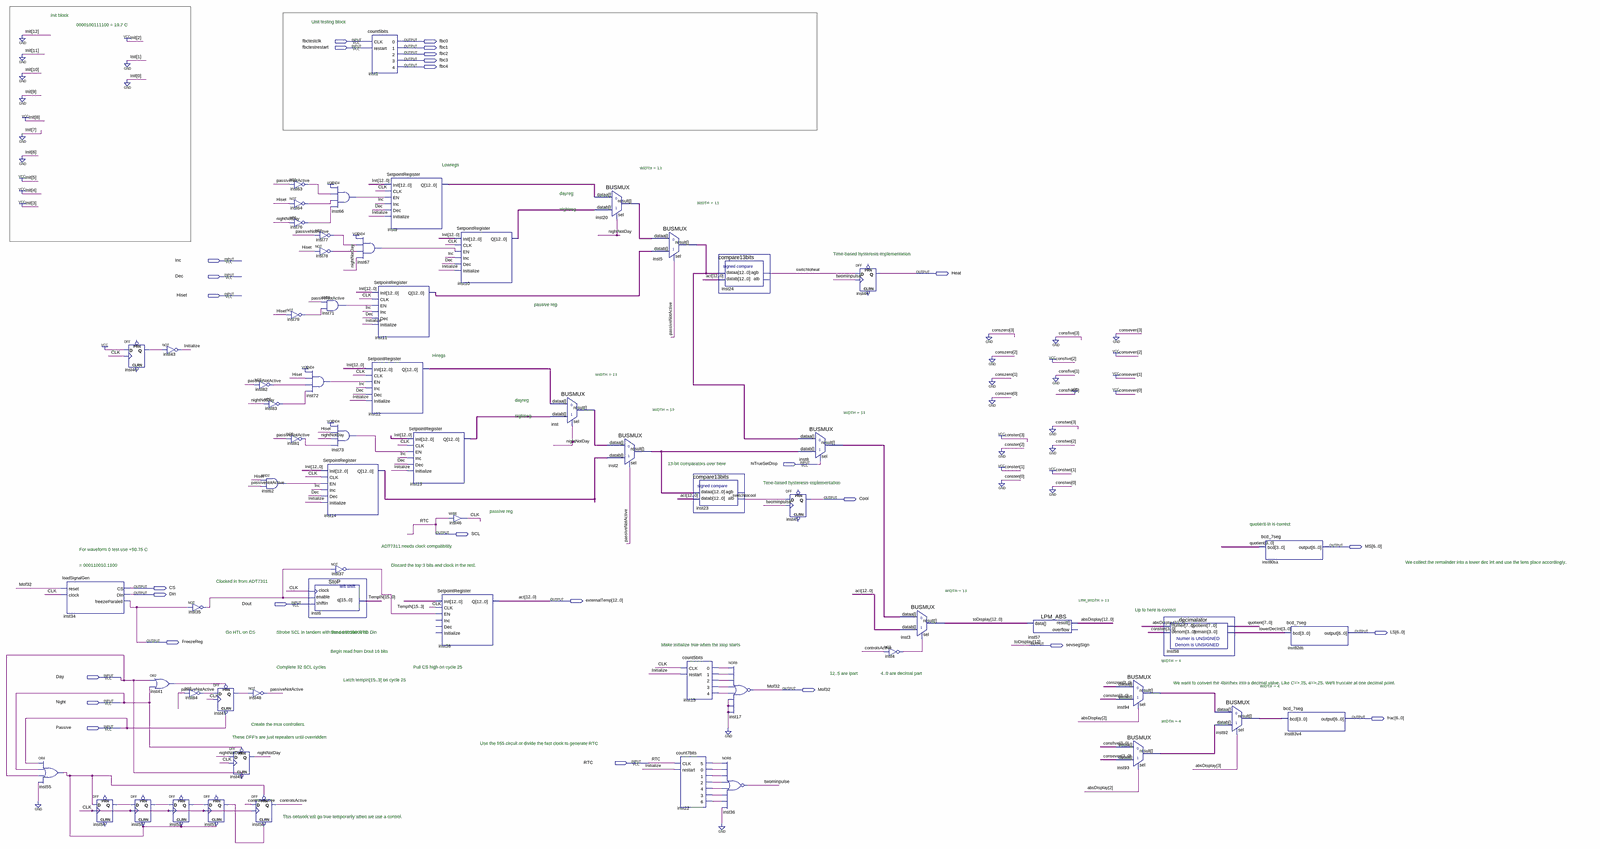
[diagram p0: schematic sheet, whole]
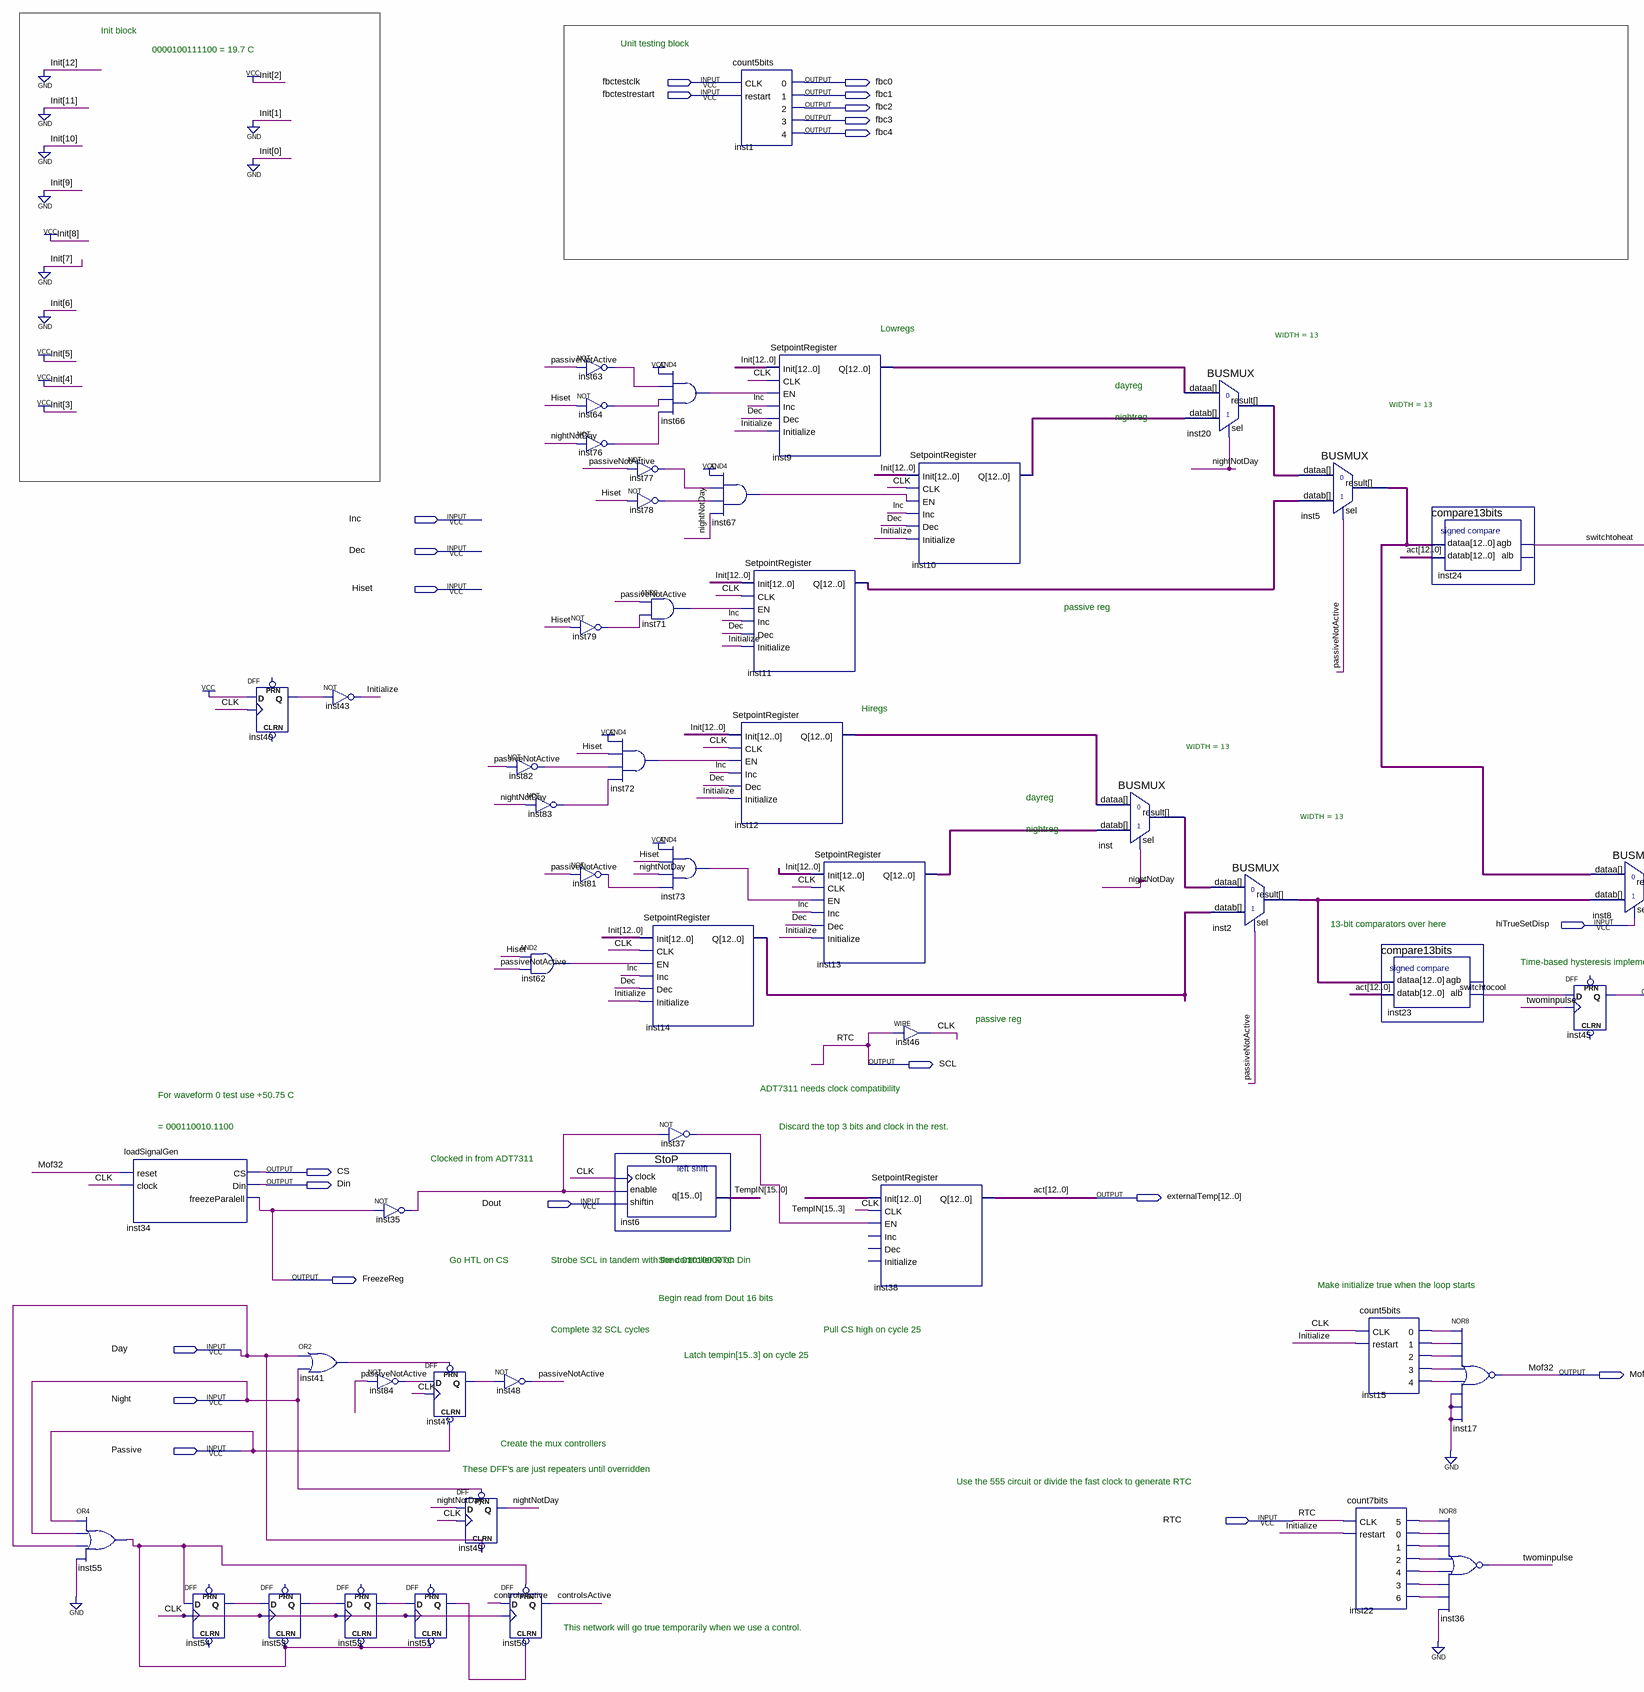
[diagram p1: schematic sheet, left part]
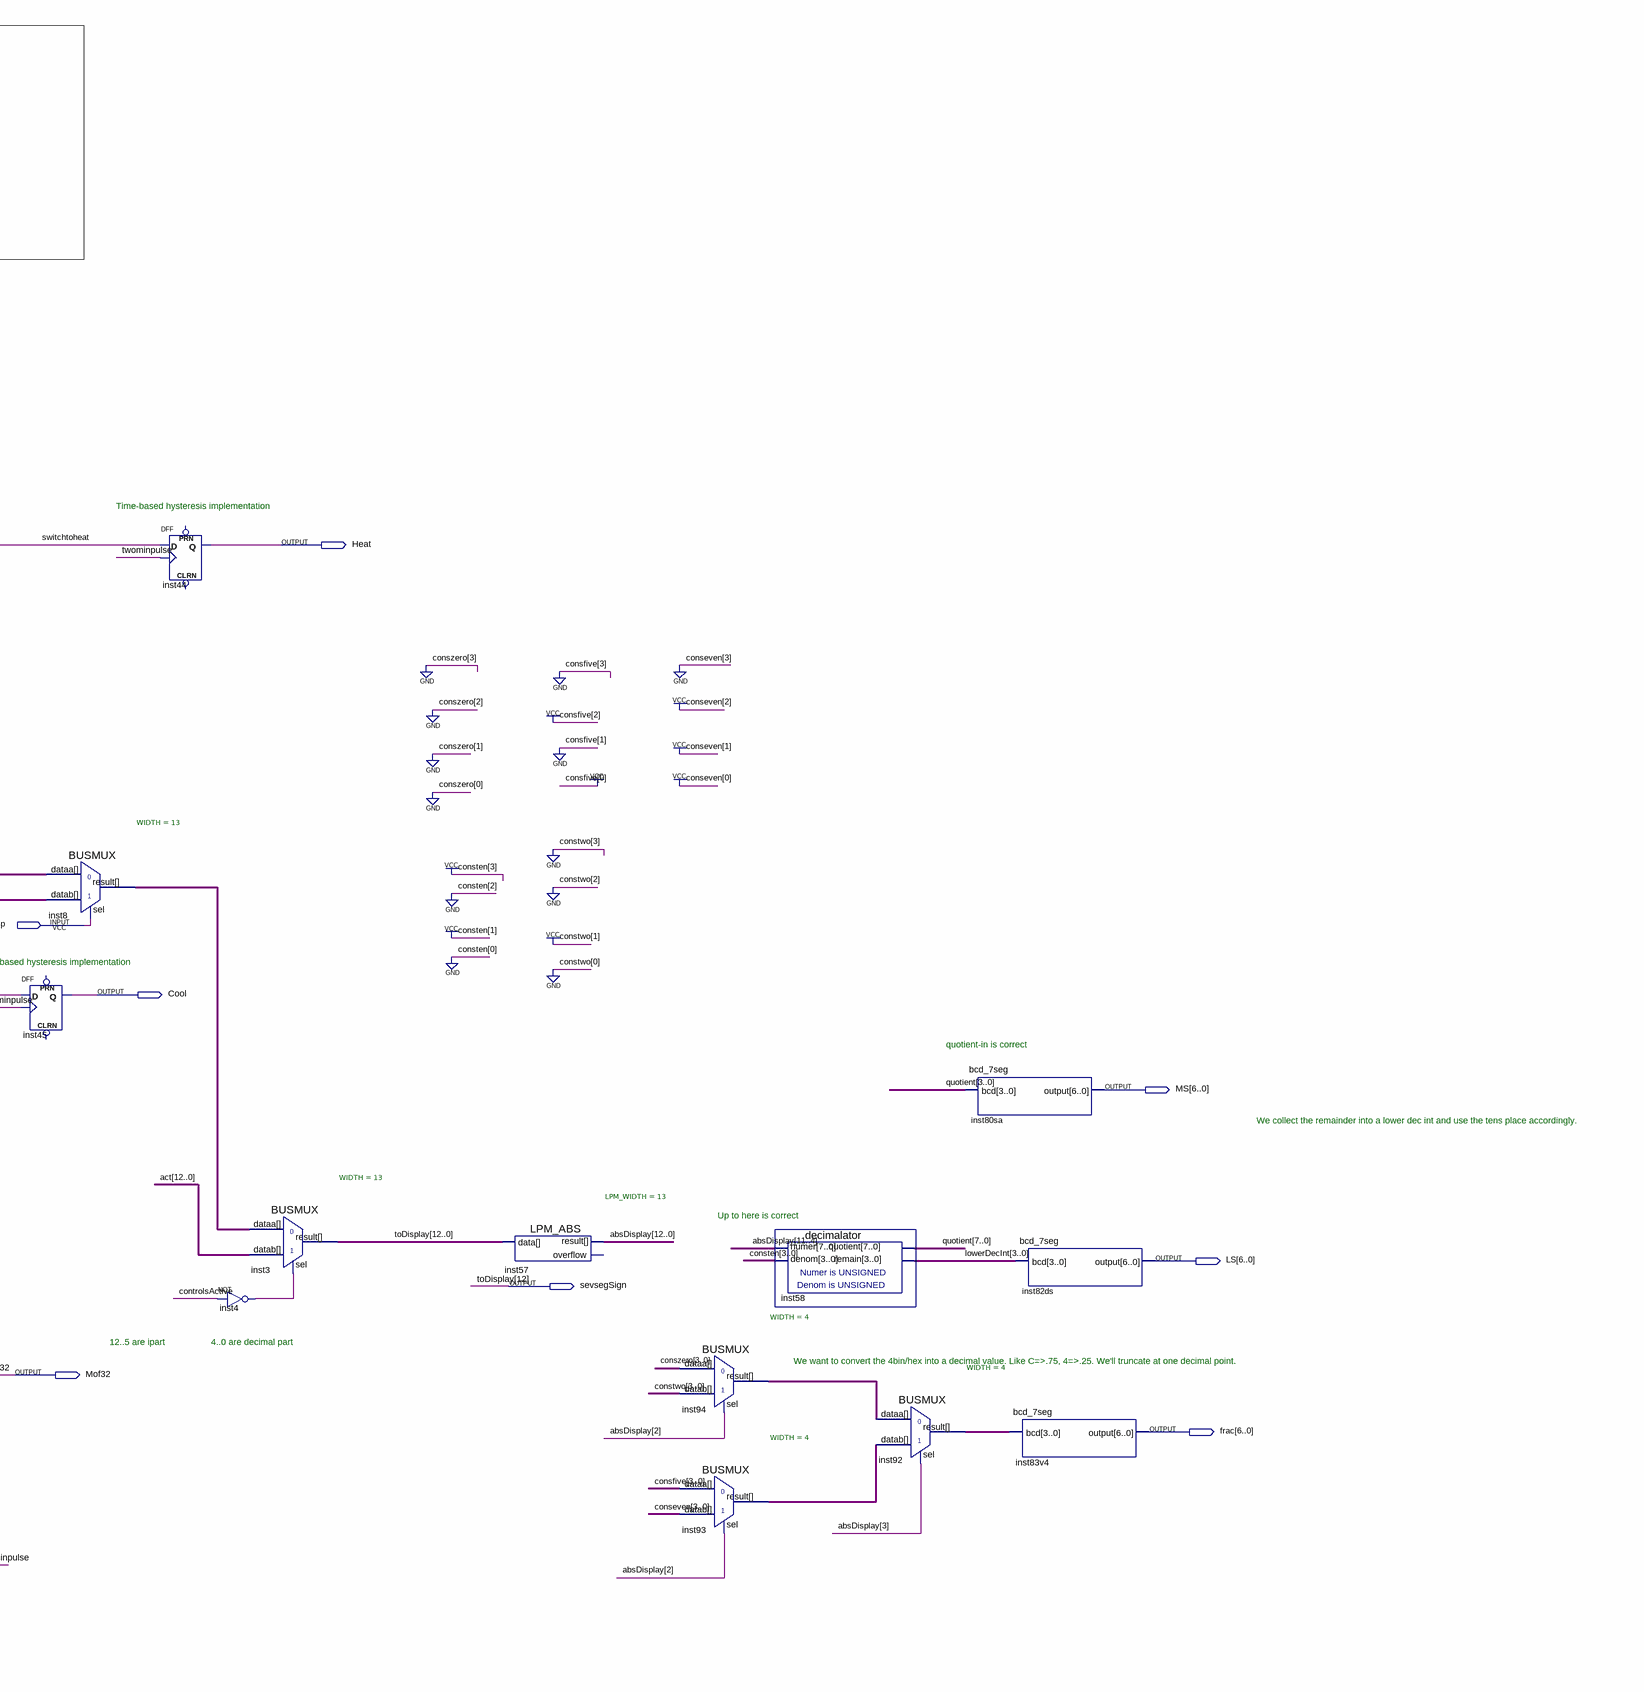
[diagram p2: schematic sheet, right part]
// Quartus schematic HexpointThermostat.bdf as structural Verilog: 64 symbols, 28 pins
module HexpointThermostat (
  input  fbctestclk,
  input  fbctestrestart,
  input  Inc,
  input  Dec,
  input  Hiset,
  input  hiTrueSetDisp,
  input  Dout,
  input  Day,
  input  Night,
  input  Passive,
  input  RTC,
  output fbc0,
  output fbc1,
  output fbc2,
  output fbc3,
  output fbc4,
  output Heat,
  output Cool,
  output SCL,
  output [6:0] MS,
  output CS,
  output Din,
  output [12:0] externalTemp,
  output [6:0] LS,
  output FreezeReg,
  output sevsegSign,
  output Mof32,
  output [6:0] frac
);

  wire CLK, controlsActive, Initialize, inst4_out, inst15_0, inst15_1, inst15_2, inst15_3, inst15_4,
       inst22_0, inst22_1, inst22_2, inst22_3, inst22_4, inst22_5, inst22_6, inst35_out, inst37_out,
       inst40_q, inst41_out, inst47_q, inst51_q, inst52_q, inst53_q, inst54_q, inst55_out, inst62_out,
       inst63_out, inst64_out, inst66_out, inst67_out, inst71_out, inst72_out, inst73_out, inst76_out,
       inst77_out, inst78_out, inst79_out, inst81_out, inst82_out, inst83_out, inst84_out, nightNotDay,
       passiveNotActive, switchtocool, switchtoheat, twominpulse;
  wire [3:0] inst92_result, inst93_result, inst94_result, lowerDecInt;
  wire [7:0] quotient;
  wire [11:0] toDisplay;
  wire [12:0] absDisplay, inst2_result, inst5_result, inst8_result, inst9_q, inst10_q, inst11_q, inst12_q,
       inst13_q, inst14_q, inst20_result, inst_result;
  wire [15:0] TempIN;

  or inst55 (inst55_out, Passive, Night, Day, 1'b0);
  loadSignalGen inst34 (.reset(Mof32), .clock(CLK), .CS(CS), .Din(Din), .freezeParalell(FreezeReg));
  DFF inst54 (.CLK(CLK), .D(inst55_out), .Q(inst54_q));  // open: CLRN, PRN
  DFF inst40 (.CLK(CLK), .D(1'b1), .Q(inst40_q));  // open: CLRN, PRN
  DFF inst53 (.CLRN(inst55_out), .CLK(CLK), .D(inst54_q), .Q(inst53_q));  // open: PRN
  not inst43 (Initialize, inst40_q);
  or inst41 (inst41_out, Day, Night);
  DFF inst52 (.CLRN(inst55_out), .CLK(CLK), .D(inst53_q), .Q(inst52_q));  // open: PRN
  not inst35 (inst35_out, FreezeReg);
  not inst84 (inst84_out, passiveNotActive);
  DFF inst47 (.CLRN(Passive), .CLK(CLK), .D(inst84_out), .PRN(inst41_out), .Q(inst47_q));
  DFF inst51 (.CLRN(inst55_out), .CLK(CLK), .D(inst52_q), .Q(inst51_q));  // open: PRN
  DFF inst49 (.CLRN(Day), .CLK(CLK), .D(nightNotDay), .PRN(Night), .Q(nightNotDay));
  not inst82 (inst82_out, passiveNotActive);
  not inst83 (inst83_out, nightNotDay);
  and inst62 (inst62_out, Hiset, passiveNotActive);
  not inst48 (passiveNotActive, inst47_q);
  DFF inst50 (.CLRN(inst51_q), .CLK(CLK), .D(controlsActive), .PRN(inst55_out), .Q(controlsActive));
  not inst63 (inst63_out, passiveNotActive);
  not inst64 (inst64_out, Hiset);
  not inst76 (inst76_out, nightNotDay);
  not inst79 (inst79_out, Hiset);
  not inst81 (inst81_out, passiveNotActive);
  not inst77 (inst77_out, passiveNotActive);
  not inst78 (inst78_out, Hiset);
  and inst71 (inst71_out, passiveNotActive, inst79_out);
  and inst72 (inst72_out, 1'b1, Hiset, inst82_out, inst83_out);
  SetpointRegister inst14 (
    .Init(13'b0000100111100), .CLK(CLK), .EN(inst62_out), .Inc(Inc), .Dec(Dec), .Initialize(Initialize),
    .Q(inst14_q));
  StoP inst6 (.clock(CLK), .enable(inst35_out), .shiftin(Dout), .q(TempIN));
  and inst66 (inst66_out, 1'b1, inst63_out, inst64_out, inst76_out);
  and inst73 (inst73_out, 1'b1, Hiset, nightNotDay, inst81_out);
  not inst37 (inst37_out, inst35_out);
  count5bits inst1 (.\0 (fbc0), .\1 (fbc1), .\2 (fbc2), .\3 (fbc3), .\4 (fbc4));  // open: CLK, restart
  and inst67 (inst67_out, 1'b1, inst77_out, inst78_out, nightNotDay);
  SetpointRegister inst11 (
    .Init(13'b0000100111100), .CLK(CLK), .EN(inst71_out), .Inc(Inc), .Dec(Dec), .Initialize(Initialize),
    .Q(inst11_q));
  SetpointRegister inst12 (
    .Init(13'b0000100111100), .CLK(CLK), .EN(inst72_out), .Inc(Inc), .Dec(Dec), .Initialize(Initialize),
    .Q(inst12_q));
  SetpointRegister inst9 (
    .Init(13'b0000100111100), .CLK(CLK), .EN(inst66_out), .Inc(Inc), .Dec(Dec), .Initialize(Initialize),
    .Q(inst9_q));
  SetpointRegister inst13 (
    .Init(13'b0000100111100), .CLK(CLK), .EN(inst73_out), .Inc(Inc), .Dec(Dec), .Initialize(Initialize),
    .Q(inst13_q));
  assign CLK = RTC;  // WIRE inst46
  SetpointRegister inst38 (
    .Init(TempIN[15:3]), .CLK(CLK), .EN(inst37_out), .Q(externalTemp));  // open: Inc, Dec, Initialize
  SetpointRegister inst10 (
    .Init(13'b0000100111100), .CLK(CLK), .EN(inst67_out), .Inc(Inc), .Dec(Dec), .Initialize(Initialize),
    .Q(inst10_q));
  BUSMUX #(.WIDTH(13)) inst (.datab(inst13_q), .sel(nightNotDay), .dataa(inst12_q), .result(inst_result));
  BUSMUX #(.WIDTH(13)) inst20 (.datab(inst10_q), .sel(nightNotDay), .dataa(inst9_q), .result(inst20_result));
  BUSMUX #(.WIDTH(13)) inst2 (.datab(inst14_q), .sel(passiveNotActive), .dataa(inst_result), .result(inst2_result));
  BUSMUX #(.WIDTH(13)) inst5 (.datab(inst11_q), .sel(passiveNotActive), .dataa(inst20_result), .result(inst5_result));
  count7bits inst22 (
    .CLK(RTC), .restart(Initialize), .\5 (inst22_5), .\0 (inst22_0), .\1 (inst22_1), .\2 (inst22_2),
    .\4 (inst22_4), .\3 (inst22_3), .\6 (inst22_6));
  compare13bits inst23 (.dataa(inst2_result), .datab(externalTemp), .alb(switchtocool));  // open: agb
  count5bits inst15 (
    .CLK(CLK), .restart(Initialize), .\0 (inst15_0), .\1 (inst15_1), .\2 (inst15_2), .\3 (inst15_3),
    .\4 (inst15_4));
  compare13bits inst24 (.dataa(inst5_result), .datab(externalTemp), .agb(switchtoheat));  // open: alb
  nor inst17 (Mof32, inst15_0, inst15_1, inst15_2, inst15_3, inst15_4, 1'b0, 1'b0, 1'b0);
  nor inst36 (twominpulse, inst22_5, inst22_0, inst22_1, inst22_2, inst22_4, inst22_3, inst22_6, 1'b0);
  BUSMUX #(.WIDTH(13)) inst8 (.datab(inst2_result), .sel(hiTrueSetDisp), .dataa(inst5_result), .result(inst8_result));
  DFF inst45 (.CLK(twominpulse), .D(switchtocool), .Q(Cool));  // open: CLRN, PRN
  DFF inst44 (.CLK(twominpulse), .D(switchtoheat), .Q(Heat));  // open: CLRN, PRN
  BUSMUX #(.WIDTH(13)) inst3 (
    .datab(externalTemp), .sel(inst4_out), .dataa(inst8_result), .result({sevsegSign, toDisplay}));
  not inst4 (inst4_out, controlsActive);
  LPM_ABS #(.LPM_WIDTH(13)) inst57 (.data({sevsegSign, toDisplay}), .result(absDisplay));  // open: overflow
  BUSMUX #(.WIDTH(4)) inst94 (.datab(4'b0010), .sel(absDisplay[2]), .dataa(4'b0000), .result(inst94_result));
  BUSMUX #(.WIDTH(4)) inst93 (.datab(4'b0111), .sel(absDisplay[2]), .dataa(4'b0101), .result(inst93_result));
  decimalator inst58 (.numer(absDisplay[11:4]), .denom(4'b1010), .quotient(quotient), .remain(lowerDecInt));
  BUSMUX #(.WIDTH(4)) inst92 (
    .datab(inst93_result), .sel(absDisplay[3]), .dataa(inst94_result), .result(inst92_result));
  bcd_7seg inst80sa (.bcd(quotient[3:0]), .\output (MS));
  bcd_7seg inst82ds (.bcd(lowerDecInt), .\output (LS));
  bcd_7seg inst83v4 (.bcd(inst92_result), .\output (frac));

  assign SCL = RTC;

  // Other names for the same wires on the sheet: act[12:0] = externalTemp; toDisplay[12] = sevsegSign

  // Notes on the sheet:
  //   Init block
  //   Unit testing block
  //   0000100111100 = 19.7 C
  //   Lowregs
  //   dayreg
  //   nightreg
  //   Time-based hysteresis implementation
  //   passive reg
  //   Hiregs
  //   dayreg
  //   nightreg
  //   13-bit comparators over here
  //   Time-based hysteresis implementation
  //   passive reg
  //   quotient-in is correct
  //   ADT7311 needs clock compatibility
  //   For waveform 0 test use +50.75 C 
  //   We collect the remainder into a lower dec int and use the tens place accordingly.
  //   = 000110010.1100
  //   Discard the top 3 bits and clock in the rest.
  //   Clocked in from ADT7311
  //   Up to here is correct
  //   Go HTL on CS
  //   Strobe SCL in tandem with the controller RTC
  //   Send 01010000 on Din
  //   Make initialize true when the loop starts
  //   Begin read from Dout 16 bits
  //   Complete 32 SCL cycles
  //   Pull CS high on cycle 25
  //   12..5 are ipart
  //   4..0 are decimal part
  //   Latch tempin[15..3] on cycle 25
  //   We want to convert the 4bin/hex into a decimal value. Like C=>.75, 4=>.25. We'll truncate at one decimal point.
  //   Create the mux controllers
  //   These DFF's are just repeaters until overridden
  //   Use the 555 circuit or divide the fast clock to generate RTC
  //   This network will go true temporarily when we use a control.
endmodule
